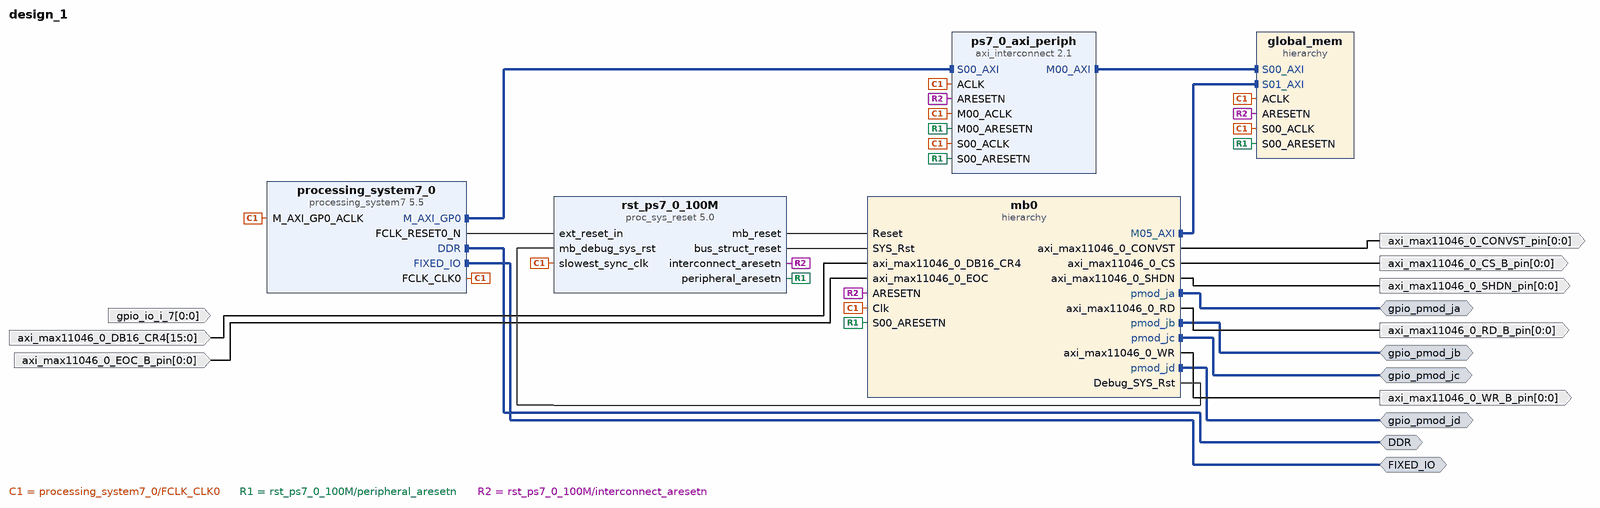
[diagram p0: block diagram of the top level]
# Vivado block design design_1, xc7z020clg484-1, Vivado 2017.1
create_bd_design design_1

create_bd_intf_port -mode Master -vlnv xilinx.com:interface:ddrx_rtl:1.0 DDR
create_bd_intf_port -mode Master -vlnv xilinx.com:display_processing_system7:fixedio_rtl:1.0 FIXED_IO
create_bd_intf_port -mode Master -vlnv xilinx.com:interface:gpio_rtl:1.0 gpio_pmod_jd
create_bd_intf_port -mode Master -vlnv xilinx.com:interface:gpio_rtl:1.0 gpio_pmod_jc
create_bd_intf_port -mode Master -vlnv xilinx.com:interface:gpio_rtl:1.0 gpio_pmod_jb
create_bd_intf_port -mode Master -vlnv xilinx.com:interface:gpio_rtl:1.0 gpio_pmod_ja
create_bd_port -dir I -from 0 -to 0 gpio_io_i_7
create_bd_port -dir I -from 15 -to 0 axi_max11046_0_DB16_CR4
create_bd_port -dir O -from 0 -to 0 axi_max11046_0_SHDN_pin
create_bd_port -dir O -from 0 -to 0 axi_max11046_0_CONVST_pin
create_bd_port -dir O -from 0 -to 0 axi_max11046_0_CS_B_pin
create_bd_port -dir O -from 0 -to 0 axi_max11046_0_RD_B_pin
create_bd_port -dir O -from 0 -to 0 axi_max11046_0_WR_B_pin
create_bd_port -dir I -from 0 -to 0 axi_max11046_0_EOC_B_pin

create_bd_cell -type ip -vlnv xilinx.com:ip:processing_system7:5.5 processing_system7_0
set_property -dict {CONFIG.PCW_QSPI_GRP_SINGLE_SS_ENABLE 1 CONFIG.preset ZedBoard} [get_bd_cells processing_system7_0]
# 2 more settings of processing_system7_0 are not shown: defaults, MIO pin electricals, DDR timing, and values the tool derives
create_bd_cell -type ip -vlnv xilinx.com:ip:axi_interconnect:2.1 ps7_0_axi_periph
set_property -dict {CONFIG.NUM_MI 1} [get_bd_cells ps7_0_axi_periph]
create_bd_cell -type ip -vlnv xilinx.com:ip:proc_sys_reset:5.0 rst_ps7_0_100M
create_bd_cell -type hier mb0
create_bd_cell -type hier global_mem

# ---- hierarchy /mb0 ----
current_bd_instance /mb0
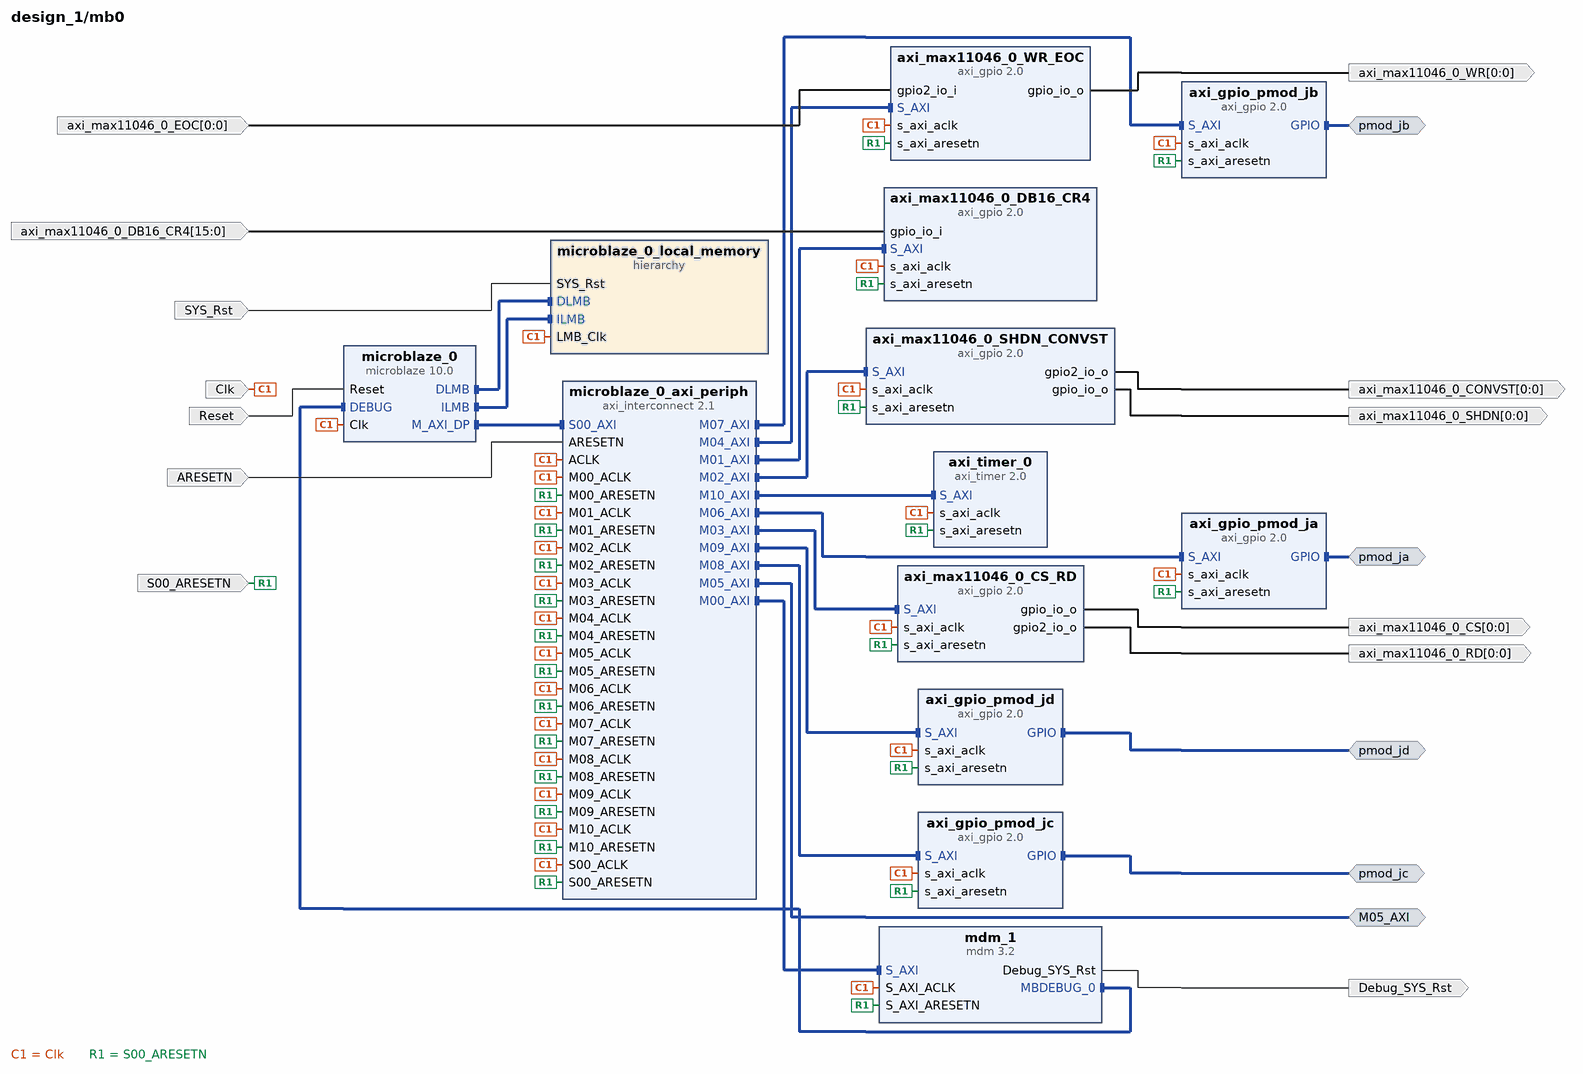
[diagram p1: block diagram inside /mb0]
create_bd_intf_pin -mode Master -vlnv xilinx.com:interface:aximm_rtl:1.0 M05_AXI
create_bd_intf_pin -mode Master -vlnv xilinx.com:interface:gpio_rtl:1.0 pmod_jd
create_bd_intf_pin -mode Master -vlnv xilinx.com:interface:gpio_rtl:1.0 pmod_jc
create_bd_intf_pin -mode Master -vlnv xilinx.com:interface:gpio_rtl:1.0 pmod_jb
create_bd_intf_pin -mode Master -vlnv xilinx.com:interface:gpio_rtl:1.0 pmod_ja
create_bd_pin -dir I -type clk Clk
create_bd_pin -dir I -type rst S00_ARESETN
create_bd_pin -dir O -type rst Debug_SYS_Rst
create_bd_pin -dir I -type rst Reset
create_bd_pin -dir I -type rst ARESETN
create_bd_pin -dir I -type rst SYS_Rst
create_bd_pin -dir I -from 15 -to 0 axi_max11046_0_DB16_CR4
create_bd_pin -dir O -from 0 -to 0 axi_max11046_0_SHDN
create_bd_pin -dir O -from 0 -to 0 axi_max11046_0_CONVST
create_bd_pin -dir O -from 0 -to 0 axi_max11046_0_CS
create_bd_pin -dir O -from 0 -to 0 axi_max11046_0_RD
create_bd_pin -dir O -from 0 -to 0 axi_max11046_0_WR
create_bd_pin -dir I -from 0 -to 0 axi_max11046_0_EOC

create_bd_cell -type ip -vlnv xilinx.com:ip:mdm:3.2 mdm_1
set_property -dict {CONFIG.C_USE_UART 1} [get_bd_cells mdm_1]
create_bd_cell -type ip -vlnv xilinx.com:ip:microblaze:10.0 microblaze_0
set_property -dict {CONFIG.C_D_AXI 1 CONFIG.C_D_LMB 1 CONFIG.C_I_LMB 1 CONFIG.C_DEBUG_ENABLED 1} [get_bd_cells microblaze_0]
create_bd_cell -type ip -vlnv xilinx.com:ip:axi_interconnect:2.1 microblaze_0_axi_periph
set_property -dict {CONFIG.NUM_MI 11} [get_bd_cells microblaze_0_axi_periph]
create_bd_cell -type hier microblaze_0_local_memory
create_bd_cell -type ip -vlnv xilinx.com:ip:axi_gpio:2.0 axi_max11046_0_DB16_CR4
set_property -dict {CONFIG.C_GPIO_WIDTH 16 CONFIG.C_ALL_INPUTS 1} [get_bd_cells axi_max11046_0_DB16_CR4]
create_bd_cell -type ip -vlnv xilinx.com:ip:axi_gpio:2.0 axi_max11046_0_SHDN_CONVST
set_property -dict [list \
  CONFIG.C_GPIO_WIDTH 1 \
  CONFIG.C_GPIO2_WIDTH 1 \
  CONFIG.C_IS_DUAL 1 \
  CONFIG.C_ALL_OUTPUTS 1 \
  CONFIG.C_ALL_OUTPUTS_2 1 \
] [get_bd_cells axi_max11046_0_SHDN_CONVST]
create_bd_cell -type ip -vlnv xilinx.com:ip:axi_gpio:2.0 axi_max11046_0_CS_RD
set_property -dict [list \
  CONFIG.C_GPIO_WIDTH 1 \
  CONFIG.C_GPIO2_WIDTH 1 \
  CONFIG.C_IS_DUAL 1 \
  CONFIG.C_ALL_OUTPUTS 1 \
  CONFIG.C_ALL_OUTPUTS_2 1 \
] [get_bd_cells axi_max11046_0_CS_RD]
create_bd_cell -type ip -vlnv xilinx.com:ip:axi_gpio:2.0 axi_max11046_0_WR_EOC
set_property -dict [list \
  CONFIG.C_GPIO_WIDTH 1 \
  CONFIG.C_GPIO2_WIDTH 1 \
  CONFIG.C_IS_DUAL 1 \
  CONFIG.C_ALL_INPUTS_2 1 \
  CONFIG.C_ALL_OUTPUTS 1 \
] [get_bd_cells axi_max11046_0_WR_EOC]
create_bd_cell -type ip -vlnv xilinx.com:ip:axi_gpio:2.0 axi_gpio_pmod_ja
set_property -dict [list \
  CONFIG.C_GPIO_WIDTH 8 \
  CONFIG.C_ALL_INPUTS 0 \
  CONFIG.USE_BOARD_FLOW true \
  CONFIG.GPIO_BOARD_INTERFACE Custom \
] [get_bd_cells axi_gpio_pmod_ja]
create_bd_cell -type ip -vlnv xilinx.com:ip:axi_gpio:2.0 axi_gpio_pmod_jb
set_property -dict [list \
  CONFIG.C_GPIO_WIDTH 8 \
  CONFIG.USE_BOARD_FLOW true \
  CONFIG.GPIO_BOARD_INTERFACE Custom \
  CONFIG.C_ALL_OUTPUTS 0 \
] [get_bd_cells axi_gpio_pmod_jb]
create_bd_cell -type ip -vlnv xilinx.com:ip:axi_gpio:2.0 axi_gpio_pmod_jc
set_property -dict [list \
  CONFIG.C_GPIO_WIDTH 8 \
  CONFIG.C_IS_DUAL 0 \
  CONFIG.C_ALL_INPUTS 0 \
  CONFIG.USE_BOARD_FLOW true \
  CONFIG.GPIO_BOARD_INTERFACE Custom \
  CONFIG.C_ALL_OUTPUTS 0 \
] [get_bd_cells axi_gpio_pmod_jc]
create_bd_cell -type ip -vlnv xilinx.com:ip:axi_gpio:2.0 axi_gpio_pmod_jd
set_property -dict [list \
  CONFIG.C_GPIO_WIDTH 8 \
  CONFIG.USE_BOARD_FLOW true \
  CONFIG.GPIO_BOARD_INTERFACE Custom \
] [get_bd_cells axi_gpio_pmod_jd]
create_bd_cell -type ip -vlnv xilinx.com:ip:axi_timer:2.0 axi_timer_0

# ---- hierarchy /mb0/microblaze_0_local_memory ----
current_bd_instance /mb0/microblaze_0_local_memory
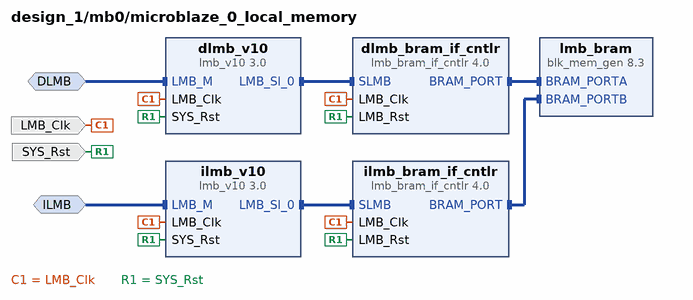
[diagram p2: block diagram inside /mb0/microblaze_0_local_memory]
create_bd_intf_pin -mode MirroredMaster -vlnv xilinx.com:interface:lmb_rtl:1.0 DLMB
create_bd_intf_pin -mode MirroredMaster -vlnv xilinx.com:interface:lmb_rtl:1.0 ILMB
create_bd_pin -dir I -type clk LMB_Clk
create_bd_pin -dir I -type rst SYS_Rst

create_bd_cell -type ip -vlnv xilinx.com:ip:lmb_v10:3.0 dlmb_v10
create_bd_cell -type ip -vlnv xilinx.com:ip:lmb_v10:3.0 ilmb_v10
create_bd_cell -type ip -vlnv xilinx.com:ip:lmb_bram_if_cntlr:4.0 dlmb_bram_if_cntlr
set_property -dict {CONFIG.C_ECC 0} [get_bd_cells dlmb_bram_if_cntlr]
create_bd_cell -type ip -vlnv xilinx.com:ip:lmb_bram_if_cntlr:4.0 ilmb_bram_if_cntlr
set_property -dict {CONFIG.C_ECC 0} [get_bd_cells ilmb_bram_if_cntlr]
create_bd_cell -type ip -vlnv xilinx.com:ip:blk_mem_gen:8.3 lmb_bram
set_property -dict {CONFIG.Memory_Type True_Dual_Port_RAM CONFIG.use_bram_block BRAM_Controller} [get_bd_cells lmb_bram]

# ---- hierarchy /global_mem ----
current_bd_instance /global_mem
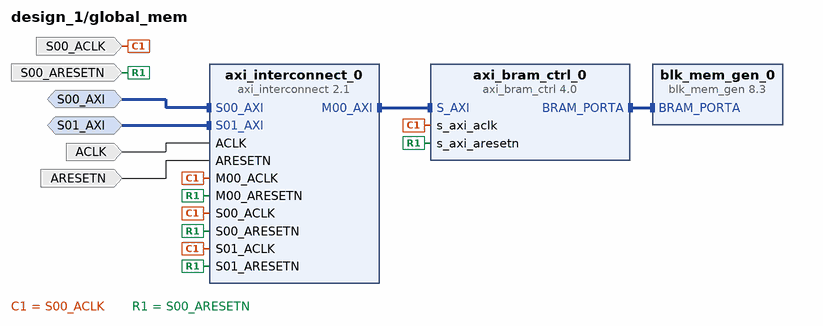
[diagram p3: block diagram inside /global_mem]
create_bd_intf_pin -mode Slave -vlnv xilinx.com:interface:aximm_rtl:1.0 S00_AXI
create_bd_intf_pin -mode Slave -vlnv xilinx.com:interface:aximm_rtl:1.0 S01_AXI
create_bd_pin -dir I -type clk ACLK
create_bd_pin -dir I -type rst ARESETN
create_bd_pin -dir I -type clk S00_ACLK
create_bd_pin -dir I -type rst S00_ARESETN

create_bd_cell -type ip -vlnv xilinx.com:ip:axi_bram_ctrl:4.0 axi_bram_ctrl_0
set_property -dict {CONFIG.SINGLE_PORT_BRAM 1} [get_bd_cells axi_bram_ctrl_0]
create_bd_cell -type ip -vlnv xilinx.com:ip:blk_mem_gen:8.3 blk_mem_gen_0
set_property -dict [list \
  CONFIG.Memory_Type Single_Port_RAM \
  CONFIG.Port_B_Clock 0 \
  CONFIG.Port_B_Write_Rate 0 \
  CONFIG.Port_B_Enable_Rate 0 \
] [get_bd_cells blk_mem_gen_0]
create_bd_cell -type ip -vlnv xilinx.com:ip:axi_interconnect:2.1 axi_interconnect_0
set_property -dict {CONFIG.NUM_SI 2 CONFIG.NUM_MI 1} [get_bd_cells axi_interconnect_0]

# ---- connections ----

current_bd_instance /mb0
connect_bd_intf_net -intf_net microblaze_0_mdm_axi [get_bd_intf_pins microblaze_0_axi_periph/M00_AXI] [get_bd_intf_pins mdm_1/S_AXI]
connect_bd_intf_net [get_bd_intf_pins mdm_1/MBDEBUG_0] [get_bd_intf_pins microblaze_0/DEBUG]
connect_bd_intf_net -intf_net microblaze_0_axi_dp [get_bd_intf_pins microblaze_0_axi_periph/S00_AXI] [get_bd_intf_pins microblaze_0/M_AXI_DP]
connect_bd_intf_net [get_bd_intf_pins microblaze_0/DLMB] [get_bd_intf_pins microblaze_0_local_memory/DLMB]
connect_bd_intf_net [get_bd_intf_pins microblaze_0/ILMB] [get_bd_intf_pins microblaze_0_local_memory/ILMB]
connect_bd_intf_net [get_bd_intf_pins microblaze_0_axi_periph/M01_AXI] [get_bd_intf_pins axi_max11046_0_DB16_CR4/S_AXI]
connect_bd_intf_net [get_bd_intf_pins microblaze_0_axi_periph/M02_AXI] [get_bd_intf_pins axi_max11046_0_SHDN_CONVST/S_AXI]
connect_bd_intf_net [get_bd_intf_pins microblaze_0_axi_periph/M03_AXI] [get_bd_intf_pins axi_max11046_0_CS_RD/S_AXI]
connect_bd_intf_net [get_bd_intf_pins microblaze_0_axi_periph/M04_AXI] [get_bd_intf_pins axi_max11046_0_WR_EOC/S_AXI]
connect_bd_intf_net [get_bd_intf_pins microblaze_0_axi_periph/M06_AXI] [get_bd_intf_pins axi_gpio_pmod_ja/S_AXI]
connect_bd_intf_net [get_bd_intf_pins microblaze_0_axi_periph/M07_AXI] [get_bd_intf_pins axi_gpio_pmod_jb/S_AXI]
connect_bd_intf_net [get_bd_intf_pins microblaze_0_axi_periph/M08_AXI] [get_bd_intf_pins axi_gpio_pmod_jc/S_AXI]
connect_bd_intf_net [get_bd_intf_pins microblaze_0_axi_periph/M09_AXI] [get_bd_intf_pins axi_gpio_pmod_jd/S_AXI]
connect_bd_intf_net [get_bd_intf_pins microblaze_0_axi_periph/M10_AXI] [get_bd_intf_pins axi_timer_0/S_AXI]
connect_bd_intf_net [get_bd_intf_pins M05_AXI] [get_bd_intf_pins microblaze_0_axi_periph/M05_AXI]
connect_bd_intf_net [get_bd_intf_pins pmod_jd] [get_bd_intf_pins axi_gpio_pmod_jd/GPIO]
connect_bd_intf_net [get_bd_intf_pins pmod_jc] [get_bd_intf_pins axi_gpio_pmod_jc/GPIO]
connect_bd_intf_net [get_bd_intf_pins pmod_jb] [get_bd_intf_pins axi_gpio_pmod_jb/GPIO]
connect_bd_intf_net [get_bd_intf_pins pmod_ja] [get_bd_intf_pins axi_gpio_pmod_ja/GPIO]
connect_bd_net -net microblaze_0_Clk [get_bd_pins Clk] \
  [get_bd_pins microblaze_0/Clk] [get_bd_pins mdm_1/S_AXI_ACLK] [get_bd_pins axi_max11046_0_DB16_CR4/s_axi_aclk] \
  [get_bd_pins axi_max11046_0_SHDN_CONVST/s_axi_aclk] [get_bd_pins axi_max11046_0_CS_RD/s_axi_aclk] \
  [get_bd_pins axi_max11046_0_WR_EOC/s_axi_aclk] [get_bd_pins axi_gpio_pmod_ja/s_axi_aclk] \
  [get_bd_pins axi_gpio_pmod_jb/s_axi_aclk] [get_bd_pins axi_gpio_pmod_jc/s_axi_aclk] \
  [get_bd_pins axi_gpio_pmod_jd/s_axi_aclk] [get_bd_pins microblaze_0_axi_periph/ACLK] \
  [get_bd_pins microblaze_0_axi_periph/S00_ACLK] [get_bd_pins microblaze_0_axi_periph/M00_ACLK] \
  [get_bd_pins microblaze_0_local_memory/LMB_Clk] [get_bd_pins microblaze_0_axi_periph/M01_ACLK] \
  [get_bd_pins microblaze_0_axi_periph/M02_ACLK] [get_bd_pins microblaze_0_axi_periph/M03_ACLK] \
  [get_bd_pins microblaze_0_axi_periph/M04_ACLK] [get_bd_pins microblaze_0_axi_periph/M05_ACLK] \
  [get_bd_pins microblaze_0_axi_periph/M06_ACLK] [get_bd_pins microblaze_0_axi_periph/M07_ACLK] \
  [get_bd_pins microblaze_0_axi_periph/M08_ACLK] [get_bd_pins microblaze_0_axi_periph/M09_ACLK] \
  [get_bd_pins axi_timer_0/s_axi_aclk] [get_bd_pins microblaze_0_axi_periph/M10_ACLK]
connect_bd_net -net rst_ps7_0_100M_peripheral_aresetn [get_bd_pins S00_ARESETN] \
  [get_bd_pins mdm_1/S_AXI_ARESETN] [get_bd_pins axi_max11046_0_DB16_CR4/s_axi_aresetn] \
  [get_bd_pins axi_max11046_0_SHDN_CONVST/s_axi_aresetn] [get_bd_pins axi_max11046_0_CS_RD/s_axi_aresetn] \
  [get_bd_pins axi_max11046_0_WR_EOC/s_axi_aresetn] [get_bd_pins axi_gpio_pmod_ja/s_axi_aresetn] \
  [get_bd_pins axi_gpio_pmod_jb/s_axi_aresetn] [get_bd_pins axi_gpio_pmod_jc/s_axi_aresetn] \
  [get_bd_pins axi_gpio_pmod_jd/s_axi_aresetn] [get_bd_pins microblaze_0_axi_periph/S00_ARESETN] \
  [get_bd_pins microblaze_0_axi_periph/M00_ARESETN] [get_bd_pins microblaze_0_axi_periph/M01_ARESETN] \
  [get_bd_pins microblaze_0_axi_periph/M02_ARESETN] [get_bd_pins microblaze_0_axi_periph/M03_ARESETN] \
  [get_bd_pins microblaze_0_axi_periph/M04_ARESETN] [get_bd_pins microblaze_0_axi_periph/M05_ARESETN] \
  [get_bd_pins microblaze_0_axi_periph/M06_ARESETN] [get_bd_pins microblaze_0_axi_periph/M07_ARESETN] \
  [get_bd_pins microblaze_0_axi_periph/M08_ARESETN] [get_bd_pins microblaze_0_axi_periph/M09_ARESETN] \
  [get_bd_pins axi_timer_0/s_axi_aresetn] [get_bd_pins microblaze_0_axi_periph/M10_ARESETN]
connect_bd_net [get_bd_pins mdm_1/Debug_SYS_Rst] [get_bd_pins Debug_SYS_Rst]
connect_bd_net -net rst_ps7_0_100M_mb_reset [get_bd_pins Reset] [get_bd_pins microblaze_0/Reset]
connect_bd_net -net rst_ps7_0_100M_interconnect_aresetn [get_bd_pins ARESETN] [get_bd_pins microblaze_0_axi_periph/ARESETN]
connect_bd_net [get_bd_pins SYS_Rst] [get_bd_pins microblaze_0_local_memory/SYS_Rst]
connect_bd_net -net gpio_io_i_1 [get_bd_pins axi_max11046_0_DB16_CR4] [get_bd_pins axi_max11046_0_DB16_CR4/gpio_io_i]
connect_bd_net [get_bd_pins axi_max11046_0_SHDN_CONVST/gpio_io_o] [get_bd_pins axi_max11046_0_SHDN]
connect_bd_net [get_bd_pins axi_max11046_0_SHDN_CONVST/gpio2_io_o] [get_bd_pins axi_max11046_0_CONVST]
connect_bd_net [get_bd_pins axi_max11046_0_CS_RD/gpio_io_o] [get_bd_pins axi_max11046_0_CS]
connect_bd_net [get_bd_pins axi_max11046_0_CS_RD/gpio2_io_o] [get_bd_pins axi_max11046_0_RD]
connect_bd_net [get_bd_pins axi_max11046_0_WR_EOC/gpio_io_o] [get_bd_pins axi_max11046_0_WR]
connect_bd_net -net gpio2_io_i_1 [get_bd_pins axi_max11046_0_EOC] [get_bd_pins axi_max11046_0_WR_EOC/gpio2_io_i]

current_bd_instance /mb0/microblaze_0_local_memory
connect_bd_intf_net -intf_net microblaze_0_dlmb_bus [get_bd_intf_pins dlmb_v10/LMB_Sl_0] [get_bd_intf_pins dlmb_bram_if_cntlr/SLMB]
connect_bd_intf_net -intf_net microblaze_0_ilmb_bus [get_bd_intf_pins ilmb_v10/LMB_Sl_0] [get_bd_intf_pins ilmb_bram_if_cntlr/SLMB]
connect_bd_intf_net -intf_net microblaze_0_dlmb_cntlr [get_bd_intf_pins dlmb_bram_if_cntlr/BRAM_PORT] [get_bd_intf_pins lmb_bram/BRAM_PORTA]
connect_bd_intf_net -intf_net microblaze_0_ilmb_cntlr [get_bd_intf_pins ilmb_bram_if_cntlr/BRAM_PORT] [get_bd_intf_pins lmb_bram/BRAM_PORTB]
connect_bd_intf_net -intf_net microblaze_0_dlmb [get_bd_intf_pins DLMB] [get_bd_intf_pins dlmb_v10/LMB_M]
connect_bd_intf_net -intf_net microblaze_0_ilmb [get_bd_intf_pins ILMB] [get_bd_intf_pins ilmb_v10/LMB_M]
connect_bd_net -net microblaze_0_Clk [get_bd_pins LMB_Clk] \
  [get_bd_pins dlmb_v10/LMB_Clk] [get_bd_pins dlmb_bram_if_cntlr/LMB_Clk] [get_bd_pins ilmb_v10/LMB_Clk] \
  [get_bd_pins ilmb_bram_if_cntlr/LMB_Clk]
connect_bd_net [get_bd_pins SYS_Rst] \
  [get_bd_pins dlmb_v10/SYS_Rst] [get_bd_pins dlmb_bram_if_cntlr/LMB_Rst] [get_bd_pins ilmb_v10/SYS_Rst] \
  [get_bd_pins ilmb_bram_if_cntlr/LMB_Rst]

current_bd_instance /global_mem
connect_bd_intf_net [get_bd_intf_pins axi_bram_ctrl_0/BRAM_PORTA] [get_bd_intf_pins blk_mem_gen_0/BRAM_PORTA]
connect_bd_intf_net [get_bd_intf_pins axi_interconnect_0/M00_AXI] [get_bd_intf_pins axi_bram_ctrl_0/S_AXI]
connect_bd_intf_net [get_bd_intf_pins S00_AXI] [get_bd_intf_pins axi_interconnect_0/S00_AXI]
connect_bd_intf_net [get_bd_intf_pins S01_AXI] [get_bd_intf_pins axi_interconnect_0/S01_AXI]
connect_bd_net [get_bd_pins ACLK] [get_bd_pins axi_interconnect_0/ACLK]
connect_bd_net [get_bd_pins ARESETN] [get_bd_pins axi_interconnect_0/ARESETN]
connect_bd_net [get_bd_pins S00_ACLK] \
  [get_bd_pins axi_bram_ctrl_0/s_axi_aclk] [get_bd_pins axi_interconnect_0/S00_ACLK] \
  [get_bd_pins axi_interconnect_0/M00_ACLK] [get_bd_pins axi_interconnect_0/S01_ACLK]
connect_bd_net [get_bd_pins S00_ARESETN] \
  [get_bd_pins axi_bram_ctrl_0/s_axi_aresetn] [get_bd_pins axi_interconnect_0/S00_ARESETN] \
  [get_bd_pins axi_interconnect_0/M00_ARESETN] [get_bd_pins axi_interconnect_0/S01_ARESETN]

current_bd_instance /
connect_bd_intf_net [get_bd_intf_pins processing_system7_0/M_AXI_GP0] [get_bd_intf_pins ps7_0_axi_periph/S00_AXI]
connect_bd_intf_net [get_bd_intf_pins mb0/M05_AXI] [get_bd_intf_pins global_mem/S01_AXI]
connect_bd_intf_net [get_bd_intf_pins global_mem/S00_AXI] [get_bd_intf_pins ps7_0_axi_periph/M00_AXI]
connect_bd_intf_net [get_bd_intf_ports DDR] [get_bd_intf_pins processing_system7_0/DDR]
connect_bd_intf_net [get_bd_intf_ports FIXED_IO] [get_bd_intf_pins processing_system7_0/FIXED_IO]
connect_bd_intf_net -intf_net mb0_GPIO [get_bd_intf_ports gpio_pmod_jd] [get_bd_intf_pins mb0/pmod_jd]
connect_bd_intf_net -intf_net mb0_GPIO1 [get_bd_intf_ports gpio_pmod_jc] [get_bd_intf_pins mb0/pmod_jc]
connect_bd_intf_net -intf_net mb0_GPIO2 [get_bd_intf_ports gpio_pmod_jb] [get_bd_intf_pins mb0/pmod_jb]
connect_bd_intf_net -intf_net mb0_GPIO3 [get_bd_intf_ports gpio_pmod_ja] [get_bd_intf_pins mb0/pmod_ja]
connect_bd_net -net microblaze_0_Clk [get_bd_pins processing_system7_0/FCLK_CLK0] \
  [get_bd_pins processing_system7_0/M_AXI_GP0_ACLK] [get_bd_pins rst_ps7_0_100M/slowest_sync_clk] \
  [get_bd_pins ps7_0_axi_periph/S00_ACLK] [get_bd_pins ps7_0_axi_periph/M00_ACLK] [get_bd_pins ps7_0_axi_periph/ACLK] \
  [get_bd_pins mb0/Clk] [get_bd_pins global_mem/ACLK] [get_bd_pins global_mem/S00_ACLK]
connect_bd_net [get_bd_pins processing_system7_0/FCLK_RESET0_N] [get_bd_pins rst_ps7_0_100M/ext_reset_in]
connect_bd_net [get_bd_pins rst_ps7_0_100M/peripheral_aresetn] \
  [get_bd_pins ps7_0_axi_periph/S00_ARESETN] [get_bd_pins ps7_0_axi_periph/M00_ARESETN] [get_bd_pins mb0/S00_ARESETN] \
  [get_bd_pins global_mem/S00_ARESETN]
connect_bd_net [get_bd_pins rst_ps7_0_100M/interconnect_aresetn] \
  [get_bd_pins ps7_0_axi_periph/ARESETN] [get_bd_pins mb0/ARESETN] [get_bd_pins global_mem/ARESETN]
connect_bd_net [get_bd_pins rst_ps7_0_100M/mb_reset] [get_bd_pins mb0/Reset]
connect_bd_net -net mdm_1_debug_sys_rst [get_bd_pins mb0/Debug_SYS_Rst] [get_bd_pins rst_ps7_0_100M/mb_debug_sys_rst]
connect_bd_net [get_bd_pins rst_ps7_0_100M/bus_struct_reset] [get_bd_pins mb0/SYS_Rst]
connect_bd_net -net gpio_io_i_8 [get_bd_ports axi_max11046_0_DB16_CR4] [get_bd_pins mb0/axi_max11046_0_DB16_CR4]
connect_bd_net -net mb0_gpio_io_o [get_bd_pins mb0/axi_max11046_0_SHDN] [get_bd_ports axi_max11046_0_SHDN_pin]
connect_bd_net -net mb0_gpio2_io_o [get_bd_pins mb0/axi_max11046_0_CONVST] [get_bd_ports axi_max11046_0_CONVST_pin]
connect_bd_net -net mb0_gpio_io_o1 [get_bd_pins mb0/axi_max11046_0_CS] [get_bd_ports axi_max11046_0_CS_B_pin]
connect_bd_net -net mb0_gpio2_io_o1 [get_bd_pins mb0/axi_max11046_0_RD] [get_bd_ports axi_max11046_0_RD_B_pin]
connect_bd_net -net mb0_gpio_io_o2 [get_bd_pins mb0/axi_max11046_0_WR] [get_bd_ports axi_max11046_0_WR_B_pin]
connect_bd_net -net gpio2_io_i_1 [get_bd_ports axi_max11046_0_EOC_B_pin] [get_bd_pins mb0/axi_max11046_0_EOC]

# ---- address map ----
assign_bd_address -offset 0x00000000 -range 128K -target_address_space [get_bd_addr_spaces mb0/microblaze_0/Data] [get_bd_addr_segs mb0/microblaze_0_local_memory/dlmb_bram_if_cntlr/SLMB/Mem]
assign_bd_address -offset 0x40000000 -range 64K -target_address_space [get_bd_addr_spaces mb0/microblaze_0/Data] [get_bd_addr_segs mb0/axi_max11046_0_DB16_CR4/S_AXI/Reg]
assign_bd_address -offset 0x40010000 -range 64K -target_address_space [get_bd_addr_spaces mb0/microblaze_0/Data] [get_bd_addr_segs mb0/axi_max11046_0_SHDN_CONVST/S_AXI/Reg]
assign_bd_address -offset 0x40020000 -range 64K -target_address_space [get_bd_addr_spaces mb0/microblaze_0/Data] [get_bd_addr_segs mb0/axi_max11046_0_CS_RD/S_AXI/Reg]
assign_bd_address -offset 0x40030000 -range 64K -target_address_space [get_bd_addr_spaces mb0/microblaze_0/Data] [get_bd_addr_segs mb0/axi_max11046_0_WR_EOC/S_AXI/Reg]
assign_bd_address -offset 0x40040000 -range 64K -target_address_space [get_bd_addr_spaces mb0/microblaze_0/Data] [get_bd_addr_segs mb0/axi_gpio_pmod_ja/S_AXI/Reg]
assign_bd_address -offset 0x40050000 -range 64K -target_address_space [get_bd_addr_spaces mb0/microblaze_0/Data] [get_bd_addr_segs mb0/axi_gpio_pmod_jb/S_AXI/Reg]
assign_bd_address -offset 0x40060000 -range 64K -target_address_space [get_bd_addr_spaces mb0/microblaze_0/Data] [get_bd_addr_segs mb0/axi_gpio_pmod_jc/S_AXI/Reg]
assign_bd_address -offset 0x40070000 -range 64K -target_address_space [get_bd_addr_spaces mb0/microblaze_0/Data] [get_bd_addr_segs mb0/axi_gpio_pmod_jd/S_AXI/Reg]
assign_bd_address -offset 0x41400000 -range 4K -target_address_space [get_bd_addr_spaces mb0/microblaze_0/Data] [get_bd_addr_segs mb0/mdm_1/S_AXI/Reg]
assign_bd_address -offset 0x41C00000 -range 64K -target_address_space [get_bd_addr_spaces mb0/microblaze_0/Data] [get_bd_addr_segs mb0/axi_timer_0/S_AXI/Reg]
assign_bd_address -offset 0x42000000 -range 8K -target_address_space [get_bd_addr_spaces mb0/microblaze_0/Data] [get_bd_addr_segs global_mem/axi_bram_ctrl_0/S_AXI/Mem0]
assign_bd_address -offset 0x00000000 -range 128K -target_address_space [get_bd_addr_spaces mb0/microblaze_0/Instruction] [get_bd_addr_segs mb0/microblaze_0_local_memory/ilmb_bram_if_cntlr/SLMB/Mem]
assign_bd_address -offset 0x42000000 -range 8K -target_address_space [get_bd_addr_spaces processing_system7_0/Data] [get_bd_addr_segs global_mem/axi_bram_ctrl_0/S_AXI/Mem0]

validate_bd_design
save_bd_design
